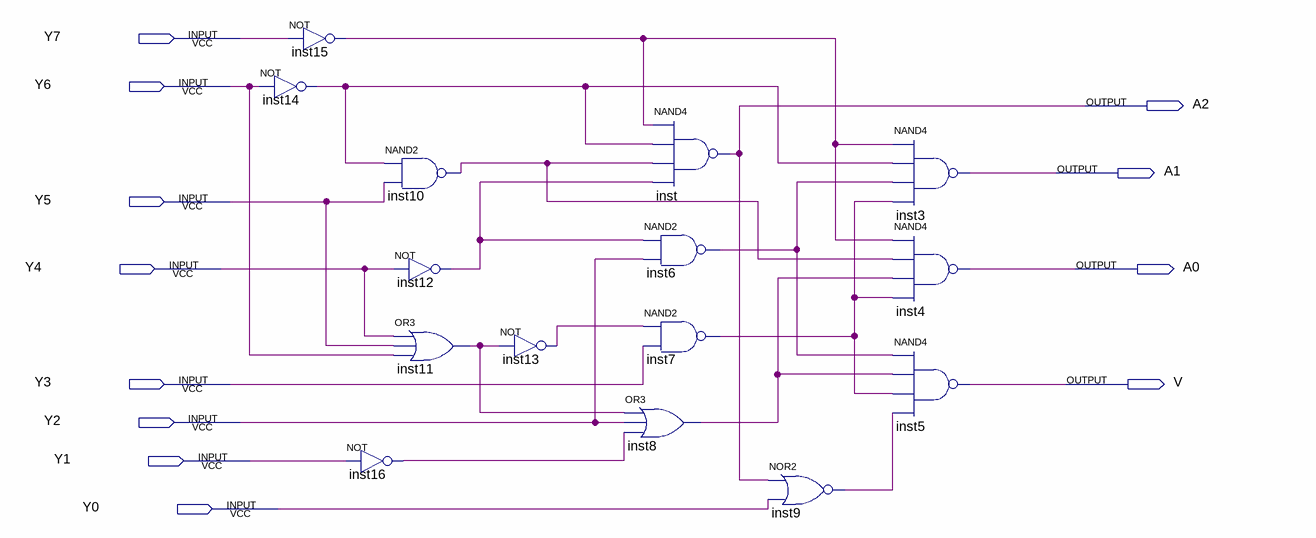
[diagram p0: schematic sheet]
// Quartus schematic encoder_8to3.bdf as structural Verilog: 15 symbols, 12 pins
module encoder_8to3 (
  input  Y7,
  input  Y6,
  input  Y5,
  input  Y4,
  input  Y3,
  input  Y2,
  input  Y1,
  input  Y0,
  output A2,
  output A1,
  output A0,
  output V
);

  wire inst6_out, inst7_out, inst8_out, inst9_out, inst10_out, inst11_out, inst12_out, inst13_out,
       inst14_out, inst15_out, inst16_out;

  not inst14 (inst14_out, Y6);
  not inst15 (inst15_out, Y7);
  not inst16 (inst16_out, Y1);
  nand inst10 (inst10_out, inst14_out, Y5);
  not inst12 (inst12_out, Y4);
  or inst11 (inst11_out, Y4, Y5, Y6);
  not inst13 (inst13_out, inst11_out);
  nand inst (A2, inst15_out, inst14_out, inst10_out, inst12_out);
  nand inst6 (inst6_out, inst12_out, Y2);
  nand inst7 (inst7_out, inst13_out, Y3);
  or inst8 (inst8_out, inst11_out, Y2, inst16_out);
  nor inst9 (inst9_out, A2, Y0);
  nand inst3 (A1, inst15_out, inst14_out, inst6_out, inst7_out);
  nand inst4 (A0, inst15_out, inst10_out, inst8_out, inst7_out);
  nand inst5 (V, inst6_out, inst8_out, inst7_out, inst9_out);
endmodule
